# Altium project AMC_FMC_Carrier.PrjPcb (part 6 of 9)

## Sheet IPMI.SchDoc
size A4; DocumentNumber: 5; SheetNumber: 5; SheetTotal: 30
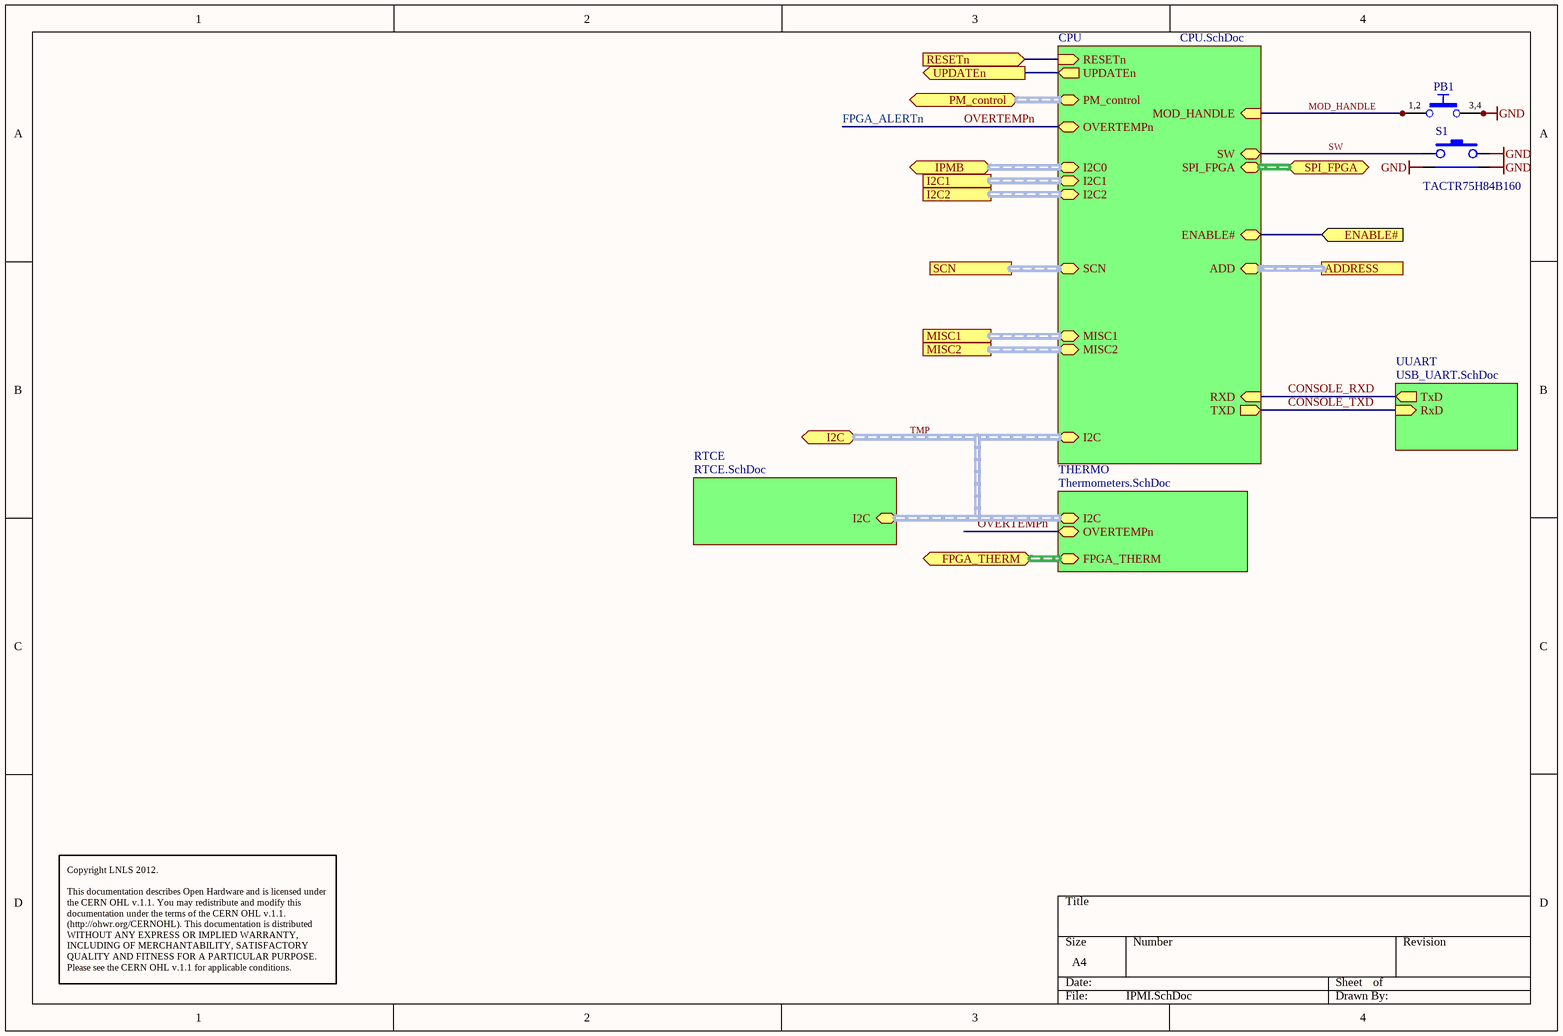
[diagram p12: IPMI.SchDoc]

### Parts
PB1  Push Button  [SW_C&K_HDT0001]  (value not drawn)
S1  TACTR75H84B160  [PB_ALPS_SKHHLQA010]

### Sub-sheets
CPU = CPU.SchDoc: ENABLE#, PM_control (harness PM_control), OVERTEMPn (bidir), MOD_HANDLE (in), SPI_FPGA (harness SPI), SW, RXD (in), TXD (out), RESETn (in), UPDATEn (out), I2C (harness I2C), I2C0 (harness I2C), I2C1 (harness I2C), I2C2 (harness I2C), MISC1 (harness MISC), MISC2 (harness MISC), ADD (harness AMC_ADD), SCN (harness SCN)
RTCE = RTCE.SchDoc (file not in this document): I2C (harness I2C)
THERMO = Thermometers.SchDoc (file not in this document): OVERTEMPn (bidir), FPGA_THERM (harness FPGA_THERM), I2C (harness I2C)
UUART = USB_UART.SchDoc: TxD (out), RxD (in)

### Ports
ADDRESS (harness AMC_ADD), ENABLE# (in), FPGA_THERM (harness FPGA_THERM), I2C1 (harness I2C), I2C2 (harness I2C), I2C (harness I2C), IPMB (harness I2C), MISC1 (harness MISC), MISC2 (harness MISC), PM_control (harness PM_control), RESETn (in), SCN (harness SCN), SPI_FPGA (harness SPI), UPDATEn (out)

### Nets
GND: PB1.3 PB1.4 S1.2 S1.3 S1.4
CONSOLE_RXD: sheet CPU/RXD, sheet UUART/TxD
CONSOLE_TXD: sheet CPU/TXD, sheet UUART/RxD
FPGA_ALERTn: sheet CPU/OVERTEMPn, sheet THERMO/OVERTEMPn  [also labelled OVERTEMPn]
MOD_HANDLE: PB1.1 PB1.2 ; sheet CPU/MOD_HANDLE
RESETn: port RESETn, sheet CPU/RESETn
SCN_ENn: port ENABLE#, sheet CPU/ENABLE#
SW: S1.1 ; sheet CPU/SW
UPDATEn: port UPDATEn, sheet CPU/UPDATEn

### Buses and harness runs
harness port ADDRESS = sheet CPU/ADD
harness port FPGA_THERM = sheet THERMO/FPGA_THERM
harness port I2C1 = sheet CPU/I2C1
harness port I2C2 = sheet CPU/I2C2
harness port IPMB = sheet CPU/I2C0
harness port MISC1 = sheet CPU/MISC1
harness port MISC2 = sheet CPU/MISC2
harness port PM_control = sheet CPU/PM_control
harness port SCN = sheet CPU/SCN
harness port SPI_FPGA = sheet CPU/SPI_FPGA
harness TMP = port I2C = sheet CPU/I2C = sheet RTCE/I2C = sheet THERMO/I2C

### Notes on the sheet
- Copyright LNLS 2012.
  This documentation describes Open Hardware and is licensed under the CERN OHL v.1.1. You may redistribute and modify this documentation under the terms of the CERN OHL v.1.1. (http://ohwr.org/CERNOHL). This documentation is distributed WITHOUT ANY EXPRESS OR IMPLIED WARRANTY, INCLUDING OF MERCHANTABILITY, SATISFACTORY QUALITY AND FITNESS FOR A PARTICULAR PURPOSE. Please see the CERN OHL v.1.1 for applicable conditions.
- (in symbol SW_C&K_HDT0001) 1,2; 3,4

### Library data of the parts
PB1 = SW_C&K_HDT0001: Push-Button Switch SPDT; Part Description: 5VDC 1mA SPST-NO Micro Mini Surface Surface Mount Detect Push-Button Switch, HDT Serie; Manufacturer: C&K; Table: Switches; Part Number: SW_C&K_HDT0001; Component Kind: Standard; Component Type: Standard; Pin Count: 4; PackageDescription: Body 3.5x2.8mm, Micro Mini Surface Mount Detect Switches, HDT Serie; Family: Push Button; Mounted: Yes; Socket: No; SMD: Yes; Status: None; Manufacturer Part Number: HDT0001; ComponentHeight: 3.35mm; HelpURL: \\cern.ch\dfs\Applications\Altium\Datasheets\SW_C&K_HDT0001.pdf; Author: CERN DEM JLC; CreateDate: 2012-08-15; LatestRevisionDate: 2012-08-15
S1 = SW-PB_RA_5.8mm: Push button

## Sheet CPU.SchDoc
size A3; DocumentNumber: 11; SheetNumber: 11; SheetTotal: 30
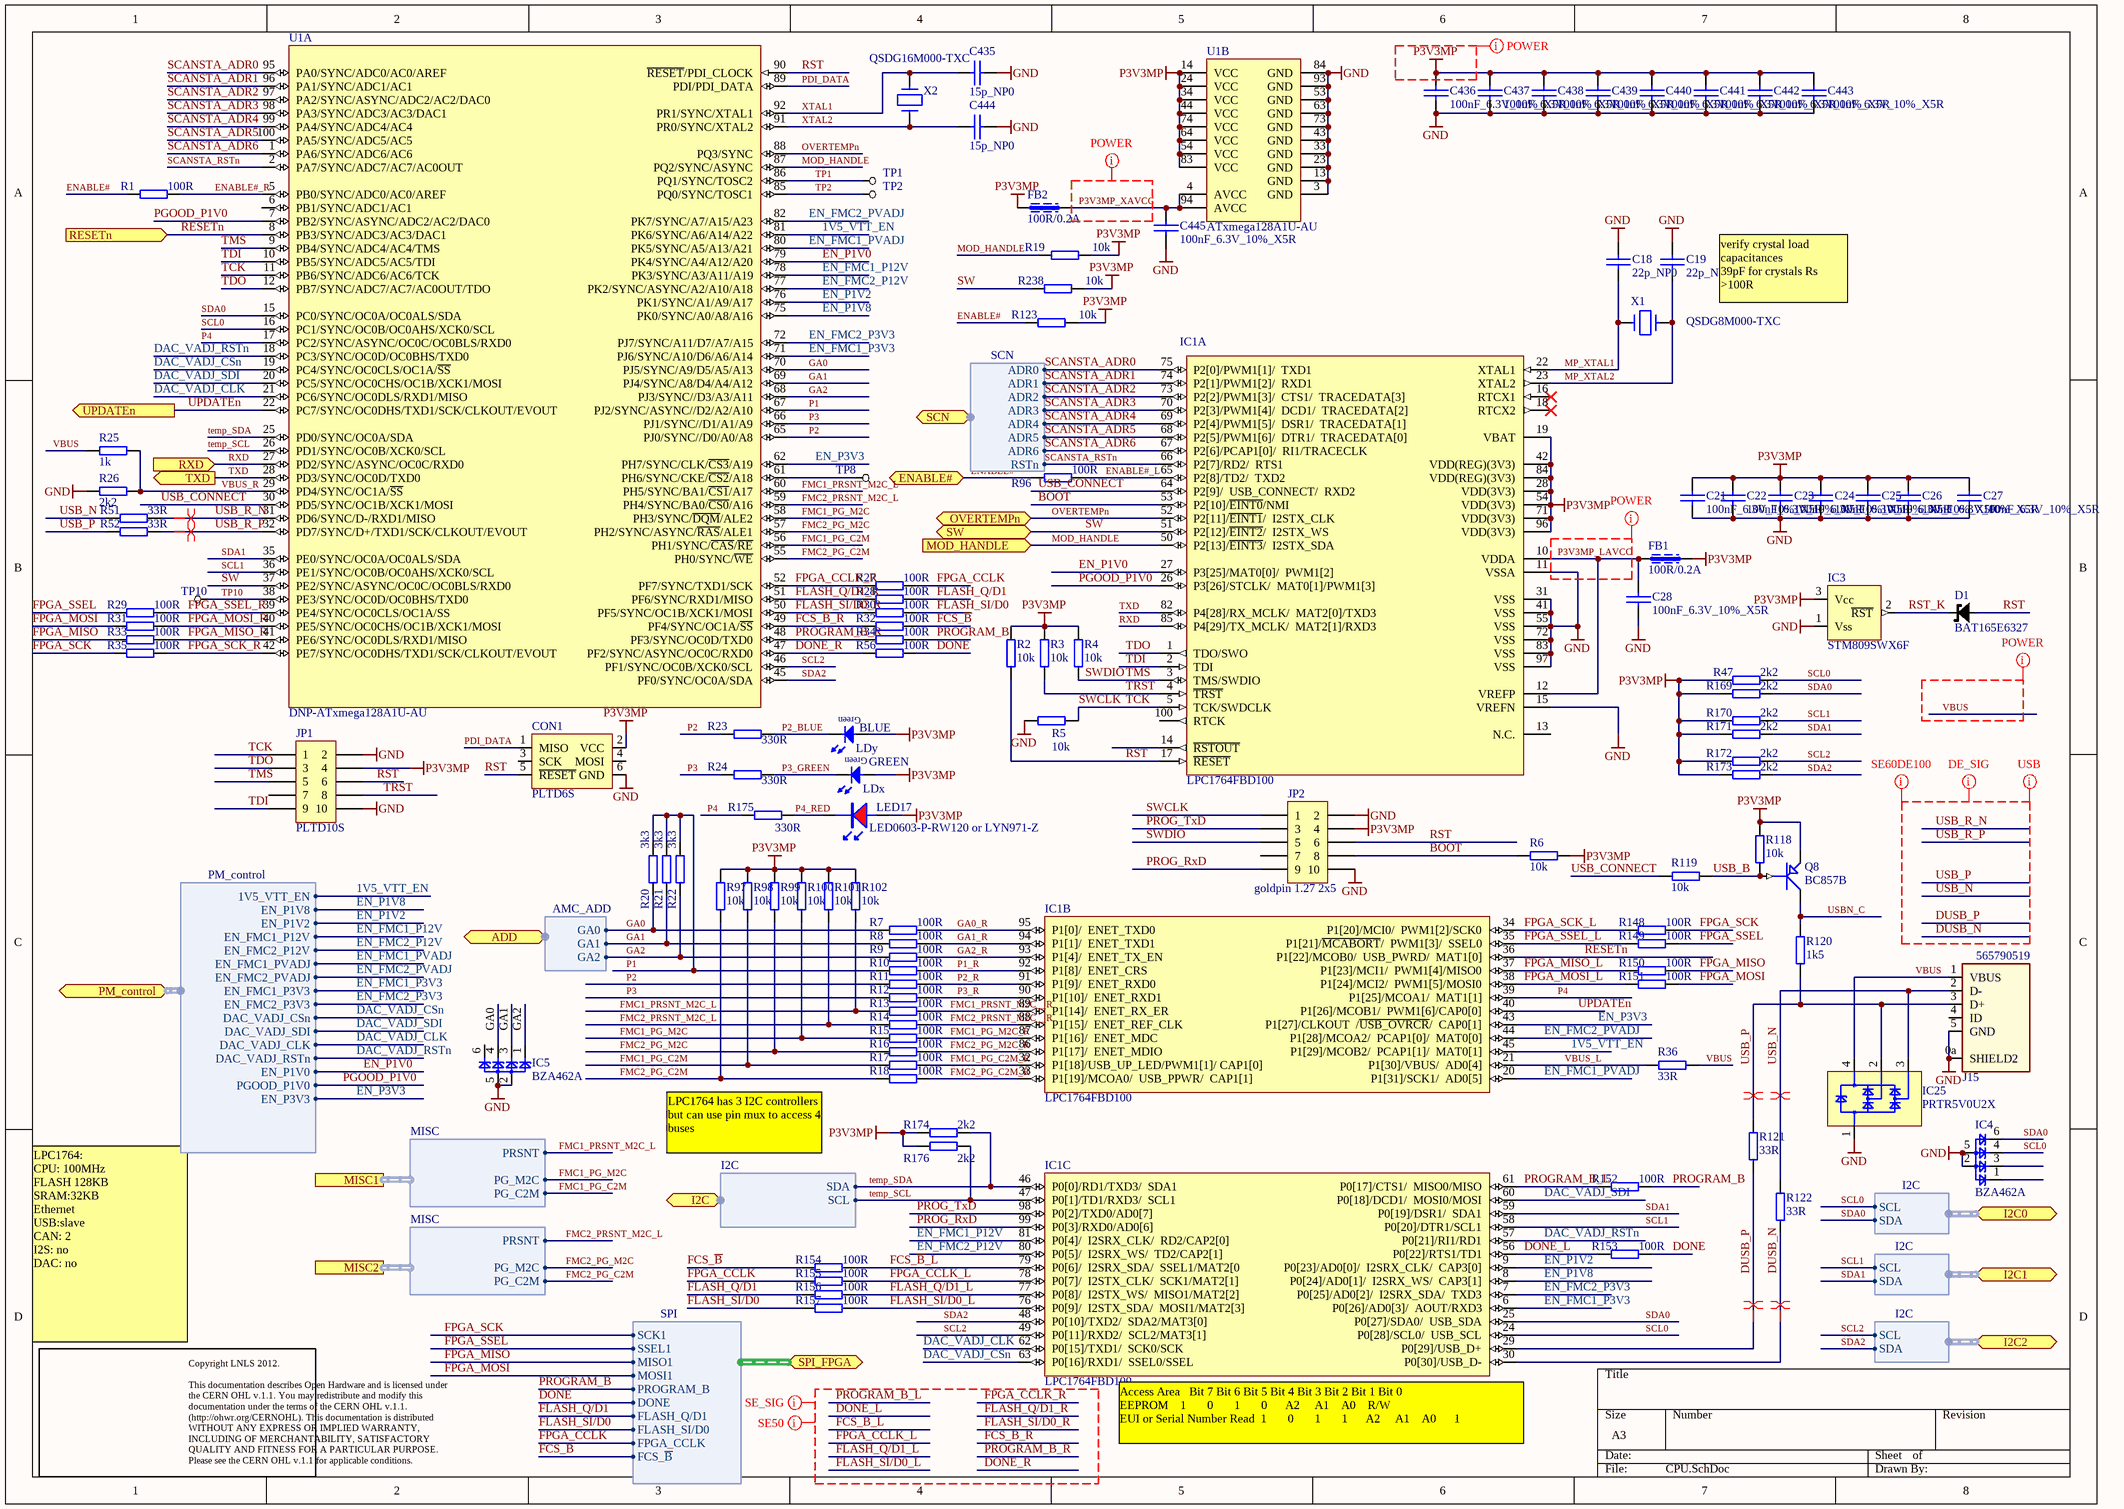
[diagram p13: CPU.SchDoc]

### Parts
C18  22p_NP0  [0402C]
C19  22p_NP0  [0402C]
C21  100nF_6.3V_10%_X5R  [0201C]
C22  100nF_6.3V_10%_X5R  [0201C]
C23  100nF_6.3V_10%_X5R  [0201C]
C24  100nF_6.3V_10%_X5R  [0201C]
C25  100nF_6.3V_10%_X5R  [0201C]
C26  100nF_6.3V_10%_X5R  [0201C]
C27  100nF_6.3V_10%_X5R  [0201C]
C28  100nF_6.3V_10%_X5R  [0201C]
C435  15p_NP0  [0402C]
C436  100nF_6.3V_10%_X5R  [0201C]
C437  100nF_6.3V_10%_X5R  [0201C]
C438  100nF_6.3V_10%_X5R  [0201C]
C439  100nF_6.3V_10%_X5R  [0201C]
C440  100nF_6.3V_10%_X5R  [0201C]
C441  100nF_6.3V_10%_X5R  [0201C]
C442  100nF_6.3V_10%_X5R  [0201C]
C443  100nF_6.3V_10%_X5R  [0201C]
C444  15p_NP0  [0402C]
C445  100nF_6.3V_10%_X5R  [0201C]
CON1  PLTD6S  [PLTD6S]
D1  BAT165E6327  [SOD323]
FB1  100R/0.2A  [0402L]
FB2  100R/0.2A  [0402L]
IC1  LPC1764FBD100  [LQFP100-LPC]  (parts A,B,C of 3)
IC3  STM809SWX6F  [SOT-23]
IC4  BZA462A  [SOT23-6]
IC5  BZA462A  [SOT23-6]
IC25  PRTR5V0U2X  [sot143b]
J15  565790519  [CON_USB_565790519]
JP1  PLTD10S  [PLTD10S]
JP2  goldpin 1.27 2x5  [CON_2x5_MINI]
LDx  GREEN  [LED_AVAGO_HSME-C120]
LDy  BLUE  [LED_AVAGO_HSME-C120]
LED17  LED0603-P-RW120 or LYN971-Z  [led_0603R]
Q8  BC857B  [SOT-23]
R1  100R  [0402R]
R2  10k  [0402R]
R3  10k  [0402R]
R4  10k  [0402R]
R5  10k  [0402R]
R6  10k  [0402R]
R7  100R  [0402R]
R8  100R  [0402R]
R9  100R  [0402R]
R10  100R  [0402R]
R11  100R  [0402R]
R12  100R  [0402R]
R13  100R  [0402R]
R14  100R  [0402R]
R15  100R  [0402R]
R16  100R  [0402R]
R17  100R  [0402R]
R18  100R  [0402R]
R19  10k  [0402R]
R20  3k3  [0402R]
R21  3k3  [0402R]
R22  3k3  [0402R]
R23  330R  [0402R]
R24  330R  [0402R]
R25  1k  [0402R]
R26  2k2  [0402R]
R27  100R  [0402R]
R28  100R  [0402R]
R29  100R  [0402R]
R30  100R  [0402R]
R31  100R  [0402R]
R32  100R  [0402R]
R33  100R  [0402R]
R34  100R  [0402R]
R35  100R  [0402R]
R36  33R  [0402R]
R47  2k2  [0402R]
R51  33R  [0402R]
R52  33R  [0402R]
R56  100R  [0402R]
R96  100R  [0402R]
R97  10k  [0402R]
R98  10k  [0402R]
R99  10k  [0402R]
R100  10k  [0402R]
R101  10k  [0402R]
R102  10k  [0402R]
R118  10k  [0402R]
R119  10k  [0402R]
R120  1k5  [0402R]
R121  33R  [0402R]
R122  33R  [0402R]
R123  10k  [0402R]
R148  100R  [0402R]
R149  100R  [0402R]
R150  100R  [0402R]
R151  100R  [0402R]
R152  100R  [0402R]
R153  100R  [0402R]
R154  100R  [0402R]
R155  100R  [0402R]
R156  100R  [0402R]
R157  100R  [0402R]
R169  2k2  [0402R]
R170  2k2  [0402R]
R171  2k2  [0402R]
R172  2k2  [0402R]
R173  2k2  [0402R]
R174  2k2  [0402R]
R175  330R  [0402R]
R176  2k2  [0402R]
R238  10k  [0402R]
TP1  TP  [TP]  (value not drawn)
TP2  TP  [TP]  (value not drawn)
TP8  TP  [TP]  (value not drawn)
TP10  TP  [TP]  (value not drawn)
U1  DNP-ATxmega128A1U-AU  [TQFP100]  (parts A,B of 2)
X1  QSDG8M000-TXC  [XTAL_5.0*3.2]
X2  QSDG16M000-TXC  [XTAL_5.0*3.2]

### Ports
ADD (harness AMC_ADD), ENABLE#, I2C0 (harness I2C), I2C1 (harness I2C), I2C2 (harness I2C), I2C (harness I2C), MISC1 (harness MISC), MISC2 (harness MISC), MOD_HANDLE (in), OVERTEMPn (bidir), PM_control (harness PM_control), RESETn (in), RXD (in), SCN (harness SCN), SPI_FPGA (harness SPI), SW, TXD (out), UPDATEn (out)

### Harnesses
SPI: SCK1, SSEL1, MISO1, MOSI1, FLASH_Q/D1, FLASH_SI/D0, PROGRAM_B, DONE, FPGA_CCLK, FCS_~{B}
PM_control: EN_P1V8, EN_P1V2, EN_FMC1_P12V, EN_FMC2_P12V, EN_FMC1_PVADJ, EN_FMC2_PVADJ, EN_FMC1_P3V3, EN_FMC2_P3V3, DAC_VADJ_CSn, DAC_VADJ_SDI, DAC_VADJ_CLK, DAC_VADJ_RSTn, 1V5_VTT_EN, EN_P1V0, PGOOD_P1V0, EN_P3V3
I2C: SCL, SDA
MISC: PRSNT, PG_M2C, PG_C2M
AMC_ADD: GA0, GA1, GA2
SCN: ADR0, ADR1, ADR2, ADR3, ADR4, ADR5, ADR6, RSTn

### Nets
GND: C18.1 C19.1 C21.1 C22.1 C23.1 C24.1 C25.1 C26.1 C27.1 C28.2 C435.1 C436.1 C437.1 C438.1 C439.1 C440.1 C441.1 C442.1 C443.1 C444.1 C445.2 CON1.6(GND) IC1.11(VSSA) IC1.15(VREFN) IC1.31(VSS) IC1.41(VSS) IC1.55(VSS) IC1.72(VSS) IC1.83(VSS) IC1.97(VSS) IC3.1(Vss) IC4.2 IC4.5 IC5.2 IC5.5 IC25.1 J15.0(SHIELD2) J15.0a(SHIELD2) J15.5(GND) JP1.2 JP1.10 JP2.2 JP2.10 R5.2 R26.2 U1.3(GND) U1.13(GND) U1.23(GND) U1.33(GND) U1.43(GND) U1.53(GND) U1.63(GND) U1.73(GND) U1.84(GND) U1.93(GND)
P3V3MP: C21.2 C22.2 C23.2 C24.2 C25.2 C26.2 C27.2 C436.2 C437.2 C438.2 C439.2 C440.2 C441.2 C442.2 C443.2 CON1.2(VCC) FB1.2 FB2.1 IC1.19(VBAT) IC1.28(VDD(3V3)) IC1.42(VDD(REG)(3V3)) IC1.54(VDD(3V3)) IC1.71(VDD(3V3)) IC1.84(VDD(REG)(3V3)) IC1.96(VDD(3V3)) IC3.3(Vcc) JP1.4 JP2.4 LDx.2(A) LDy.2(A) LED17.A Q8.2(E) R2.2 R3.2 R4.2 R6.2 R19.2 R47.1 R97.2 R98.2 R99.2 R100.2 R101.2 R102.2 R118.2 R123.2 R169.1 R170.1 R171.1 R172.1 R173.1 R174.1 R176.1 R238.2 U1.14(VCC) U1.24(VCC) U1.34(VCC) U1.44(VCC) U1.54(VCC) U1.64(VCC) U1.74(VCC) U1.83(VCC)
1V5_VTT_EN: IC1.45(P1[29]/MCOB2/__PCAP1[1]/__MAT0[1]) U1.81(PK6/SYNC/A6/A14/A22) ; port PM_control.1V5_VTT_EN  [project net PM.1V5_VTT_EN]
BOOT: IC1.53(P2[10]/~{EINT0}/NMI) JP2.8 R6.1
DAC_VADJ_CLK: IC1.62(P0[15]/TXD1/__SCK0/SCK) U1.21(PC6/SYNC/OC0DLS/RXD1/MISO) ; port PM_control.DAC_VADJ_CLK  [project net PM.DAC_VADJ_CLK]
DAC_VADJ_CSn: IC1.63(P0[16]/RXD1/__SSEL0/SSEL) U1.19(PC4/SYNC/OC0CLS/OC1A/~{SS}) ; port PM_control.DAC_VADJ_CSn  [project net PM.DAC_VADJ_CSn]
DAC_VADJ_RSTn: IC1.57(P0[21]/RI1/RD1) U1.18(PC3/SYNC/OC0D/OC0BHS/TXD0) ; port PM_control.DAC_VADJ_RSTn  [project net PM.DAC_VADJ_RSTn]
DAC_VADJ_SDI: IC1.60(P0[18]/DCD1/__MOSI0/MOSI) U1.20(PC5/SYNC/OC0CHS/OC1B/XCK1/MOSI) ; port PM_control.DAC_VADJ_SDI  [project net PM.DAC_VADJ_SDI]
DONE: R56.2 R153.2 ; port SPI_FPGA.DONE  [project net FSPI.DONE]
DONE_L: IC1.56(P0[22]/RTS1/TD1) R153.1
DONE_R: R56.1 U1.47(PF2/SYNC/ASYNC/OC0C/RXD0)
DUSB_N: IC1.30(P0[30]/USB_D-) R122.1
DUSB_P: IC1.29(P0[29]/USB_D+) R121.1
EN_FMC1_P3V3: IC1.6(P0[26]/AD0[3]/__AOUT/RXD3) U1.71(PJ6/SYNC/A10/D6/A6/A14) ; port PM_control.EN_FMC1_P3V3  [project net PM.EN_FMC1_P3V3]
EN_FMC1_P12V: IC1.81(P0[4]/__I2SRX_CLK/__RD2/CAP2[0]) U1.78(PK3/SYNC/A3/A11/A19) ; port PM_control.EN_FMC1_P12V  [project net PM.EN_FMC1_P12V]
EN_FMC1_PVADJ: IC1.20(P1[31]/SCK1/__AD0[5]) U1.80(PK5/SYNC/A5/A13/A21) ; port PM_control.EN_FMC1_PVADJ  [project net PM.EN_FMC1_PVADJ]
EN_FMC2_P3V3: IC1.7(P0[25]/AD0[2]/__I2SRX_SDA/__TXD3) U1.72(PJ7/SYNC/A11/D7/A7/A15) ; port PM_control.EN_FMC2_P3V3  [project net PM.EN_FMC2_P3V3]
EN_FMC2_P12V: IC1.80(P0[5]/__I2SRX_WS/__TD2/CAP2[1]) U1.77(PK2/SYNC/ASYNC/A2/A10/A18) ; port PM_control.EN_FMC2_P12V  [project net PM.EN_FMC2_P12V]
EN_FMC2_PVADJ: IC1.44(P1[28]/MCOA2/__PCAP1[0]/__MAT0[0]) U1.82(PK7/SYNC/A7/A15/A23) ; port PM_control.EN_FMC2_PVADJ  [project net PM.EN_FMC2_PVADJ]
EN_P1V0: IC1.27(P3[25]/MAT0[0]/__PWM1[2]) U1.79(PK4/SYNC/A4/A12/A20) ; port PM_control.EN_P1V0  [project net PM.EN_P1V0]
EN_P1V2: IC1.9(P0[23]/AD0[0]/__I2SRX_CLK/__CAP3[0]) U1.76(PK1/SYNC/A1/A9/A17) ; port PM_control.EN_P1V2  [project net PM.EN_P1V2]
EN_P1V8: IC1.8(P0[24]/AD0[1]/__I2SRX_WS/__CAP3[1]) U1.75(PK0/SYNC/A0/A8/A16) ; port PM_control.EN_P1V8  [project net PM.EN_P1V8]
EN_P3V3: IC1.43(P1[27]/CLKOUT__/~{USB_OVRCR}/__CAP0[1]) U1.62(PH7/SYNC/CLK/~{CS3}/A19) ; port PM_control.EN_P3V3  [project net PM.EN_P3V3]
ENABLE#: R1.1 R96.1 R123.1 ; port ENABLE#  [project net SCN_ENn]
ENABLE#_L: IC1.65(P2[8]/TD2/__TXD2) R96.2
ENABLE#_R: R1.2 U1.5(PB0/SYNC/ADC0/AC0/AREF)
FCS_~{B}: R32.2 R154.1 ; port SPI_FPGA.FCS_~{B}  [project net FSPI.FCS_~{B}]
FCS_~{B}_L: IC1.79(P0[6]/__I2SRX_SDA/__SSEL1/MAT2[0) R154.2
FCS_~{B}_R: R32.1 U1.49(PF4/SYNC/OC1A/~{SS})
FLASH_Q/D1: R28.2 R156.1 ; port SPI_FPGA.FLASH_Q/D1  [project net FSPI.FLASH_Q/D1]
FLASH_Q/D1_L: IC1.77(P0[8]/__I2STX_WS/__MISO1/MAT2[2]) R156.2
FLASH_Q/D1_R: R28.1 U1.51(PF6/SYNC/RXD1/MISO)
FLASH_SI/D0: R30.2 R157.1 ; port SPI_FPGA.FLASH_SI/D0  [project net FSPI.FLASH_SI/D0]
FLASH_SI/D0_L: IC1.76(P0[9]/__I2STX_SDA/__MOSI1/MAT2[3]) R157.2
FLASH_SI/D0_R: R30.1 U1.50(PF5/SYNC/OC1B/XCK1/MOSI)
FMC1_PG_C2M: R17.1 R98.1 U1.56(PH1/SYNC/~{CAS}/~{RE}) ; port MISC1.PG_C2M  [project net MISC1.PG_C2M]
FMC1_PG_C2M_R: IC1.32(P1[18]/USB_UP_LED/PWM1[1]/_CAP1[0]) R17.2
FMC1_PG_M2C: R15.1 R100.1 U1.58(PH3/SYNC/~{DQM}/ALE2) ; port MISC1.PG_M2C  [project net MISC1.PG_M2C]
FMC1_PG_M2C_R: IC1.87(P1[16]/__ENET_MDC) R15.2
FMC1_PRSNT_M2C__R: IC1.89(P1[14]/__ENET_RX_ER) R13.2
FMC1_PRSNT_M2C_L: R13.1 R102.1 U1.60(PH5/SYNC/BA1/~{CS1}/A17) ; port MISC1.PRSNT  [project net MISC1.PRSNT]
FMC2_PG_C2M: R18.1 R97.1 U1.55(PH0/SYNC/~{WE}) ; port MISC2.PG_C2M  [project net MISC2.PG_C2M]
FMC2_PG_C2M_R: IC1.33(P1[19]/MCOA0/__USB_PPWR/__CAP1[1]) R18.2
FMC2_PG_M2C: R16.1 R99.1 U1.57(PH2/SYNC/ASYNC/~{RAS}/ALE1) ; port MISC2.PG_M2C  [project net MISC2.PG_M2C]
FMC2_PG_M2C_R: IC1.86(P1[17]/__ENET_MDIO) R16.2
FMC2_PRSNT_M2C__R: IC1.88(P1[15]/__ENET_REF_CLK) R14.2
FMC2_PRSNT_M2C_L: R14.1 R101.1 U1.59(PH4/SYNC/BA0/~{CS0}/A16) ; port MISC2.PRSNT  [project net MISC2.PRSNT]
FPGA_CCLK: R27.2 R155.1 ; port SPI_FPGA.FPGA_CCLK  [project net FSPI.FPGA_CCLK]
FPGA_CCLK_L: IC1.78(P0[7]/__I2STX_CLK/__SCK1/MAT2[1]) R155.2
FPGA_CCLK_R: R27.1 U1.52(PF7/SYNC/TXD1/SCK)
FPGA_MISO: R33.1 R150.2 ; port SPI_FPGA.MISO1  [project net FSPI.MISO1]
FPGA_MISO_L: IC1.37(P1[23]/MCI1/__PWM1[4]/MISO0) R150.1
FPGA_MISO_R: R33.2 U1.41(PE6/SYNC/OC0DLS/RXD1/MISO)
FPGA_MOSI: R31.1 R151.2 ; port SPI_FPGA.MOSI1  [project net FSPI.MOSI1]
FPGA_MOSI_L: IC1.38(P1[24]/MCI2/__PWM1[5]/MOSI0) R151.1
FPGA_MOSI_R: R31.2 U1.40(PE5/SYNC/OC0CHS/OC1B/XCK1/MOSI)
FPGA_SCK: R35.1 R148.2 ; port SPI_FPGA.SCK1  [project net FSPI.SCK1]
FPGA_SCK_L: IC1.34(P1[20]/MCI0/__PWM1[2]/SCK0) R148.1
FPGA_SCK_R: R35.2 U1.42(PE7/SYNC/OC0DHS/TXD1/SCK/CLKOUT/EVOUT)
FPGA_SSEL: R29.1 R149.2 ; port SPI_FPGA.SSEL1  [project net FSPI.SSEL1]
FPGA_SSEL_L: IC1.35(P1[21]/~{MCABORT}/__PWM1[3]/__SSEL0) R149.1
FPGA_SSEL_R: R29.2 U1.39(PE4/SYNC/OC0CLS/OC1A/SS)
GA0: IC5.4 R7.1 R20.1 U1.70(PJ5/SYNC/A9/D5/A5/A13) ; port ADD.GA0  [project net ADD.GA0]
GA0_R: IC1.95(P1[0]/__ENET_TXD0) R7.2
GA1: IC5.3 R8.1 R21.1 U1.69(PJ4/SYNC/A8/D4/A4/A12) ; port ADD.GA1  [project net ADD.GA1]
GA1_R: IC1.94(P1[1]/__ENET_TXD1) R8.2
GA2: IC5.1 R9.1 R22.1 U1.68(PJ3/SYNC//D3/A3/A11) ; port ADD.GA2  [project net ADD.GA2]
GA2_R: IC1.93(P1[4]/__ENET_TX_EN) R9.2
MOD_HANDLE: IC1.50(P2[13]/~{EINT3}/__I2STX_SDA) R19.1 U1.87(PQ2/SYNC/ASYNC) ; port MOD_HANDLE
MP_XTAL1: C18.2 IC1.22(XTAL1) X1.1
MP_XTAL2: C19.2 IC1.23(XTAL2) X1.2
OVERTEMPn: IC1.52(P2[11]/~{EINT1}/__I2STX_CLK) U1.88(PQ3/SYNC) ; port OVERTEMPn  [project net FPGA_ALERTn]
P1: R10.1 R20.2 R21.2 R22.2 U1.67(PJ2/SYNC/ASYNC//D2/A2/A10)
P1_R: IC1.92(P1[8]/__ENET_CRS) R10.2
P2: R11.1 R23.1 U1.65(PJ0/SYNC//D0/A0/A8)
P2_BLUE: LDy.1(C) R23.2
P2_R: IC1.91(P1[9]/__ENET_RXD0) R11.2
P3: R12.1 R24.1 U1.66(PJ1/SYNC//D1/A1/A9)
P3_GREEN: LDx.1(C) R24.2
P3_R: IC1.90(P1[10]/__ENET_RXD1) R12.2
P3V3MP_LAVCC: C28.1 FB1.1 IC1.10(VDDA) IC1.12(VREFP)
P3V3MP_XAVCC: C445.1 FB2.2 U1.4(AVCC) U1.94(AVCC)
P4: IC1.39(P1[25]/MCOA1/__MAT1[1]) R175.1 U1.17(PC2/SYNC/ASYNC/OC0C/OC0BLS/RXD0)
P4_RED: LED17.K R175.2
PDI_DATA: CON1.1(MISO) U1.89(PDI/PDI_DATA)
PGOOD_P1V0: IC1.26(P3[26]/STCLK/__MAT0[1]/PWM1[3]) U1.7(PB2/SYNC/ASYNC/ADC2/AC2/DAC0) ; port PM_control.PGOOD_P1V0  [project net PM.PGOOD_P1V0]
PROG_RxD: IC1.99(P0[3]/RXD0/AD0[6]) JP2.9
PROG_TxD: IC1.98(P0[2]/TXD0/AD0[7]) JP2.3
PROGRAM_B: R34.2 R152.2 ; port SPI_FPGA.PROGRAM_B  [project net FSPI.PROGRAM_B]
PROGRAM_B_L: IC1.61(P0[17]/CTS1/__MISO0/MISO) R152.1
PROGRAM_B_R: R34.1 U1.48(PF3/SYNC/OC0D/TXD0)
RESETn: IC1.36(P1[22]/MCOB0/__USB_PWRD/__MAT1[0]) U1.8(PB3/SYNC/ADC3/AC3/DAC1) ; port RESETn
RST: CON1.5(~{RESET}) D1.A IC1.17(~{RESET}) JP1.6 JP2.6 R2.1 U1.90(~{RESET}/PDI_CLOCK)
RST_K: D1.K IC3.2(~{RST})
RXD: IC1.85(P4[29]/TX_MCLK/__MAT2[1]/RXD3) U1.27(PD2/SYNC/ASYNC/OC0C/RXD0) ; port RXD  [project net CONSOLE_RXD]
SCANSTA_ADR0: IC1.75(P2[0]/PWM1[1]/__TXD1) U1.95(PA0/SYNC/ADC0/AC0/AREF) ; port SCN.ADR0  [project net SCN.ADR0]
SCANSTA_ADR1: IC1.74(P2[1]/PWM1[2]/__RXD1) U1.96(PA1/SYNC/ADC1/AC1) ; port SCN.ADR1  [project net SCN.ADR1]
SCANSTA_ADR2: IC1.73(P2[2]/PWM1[3]/__CTS1/__TRACEDATA[3]) U1.97(PA2/SYNC/ASYNC/ADC2/AC2/DAC0) ; port SCN.ADR2  [project net SCN.ADR2]
SCANSTA_ADR3: IC1.70(P2[3]/PWM1[4]/__DCD1/__TRACEDATA[2]) U1.98(PA3/SYNC/ADC3/AC3/DAC1) ; port SCN.ADR3  [project net SCN.ADR3]
SCANSTA_ADR4: IC1.69(P2[4]/PWM1[5]/__DSR1/__TRACEDATA[1]) U1.99(PA4/SYNC/ADC4/AC4) ; port SCN.ADR4  [project net SCN.ADR4]
SCANSTA_ADR5: IC1.68(P2[5]/PWM1[6]/__DTR1/__TRACEDATA[0]) U1.100(PA5/SYNC/ADC5/AC5) ; port SCN.ADR5  [project net SCN.ADR5]
SCANSTA_ADR6: IC1.67(P2[6]/PCAP1[0]/__RI1/TRACECLK) U1.1(PA6/SYNC/ADC6/AC6) ; port SCN.ADR6  [project net SCN.ADR6]
SCANSTA_RSTn: IC1.66(P2[7]/RD2/__RTS1) U1.2(PA7/SYNC/ADC7/AC7/AC0OUT) ; port SCN.RSTn  [project net SCN.RSTn]
SCL0: IC1.24(P0[28]/SCL0/__USB_SCL) IC4.4 R47.2 U1.16(PC1/SYNC/OC0B/OC0AHS/XCK0/SCL) ; port I2C0.SCL  [project net IPMB.SCL]
SCL1: IC1.58(P0[20]/DTR1/SCL1) R170.2 U1.36(PE1/SYNC/OC0B/OC0AHS/XCK0/SCL) ; port I2C1.SCL  [project net I2C1.SCL]
SCL2: IC1.49(P0[11]/RXD2/__SCL2/MAT3[1]) R172.2 U1.46(PF1/SYNC/OC0B/XCK0/SCL) ; port I2C2.SCL  [project net I2C2.SCL]
SDA0: IC1.25(P0[27]/SDA0/__USB_SDA) IC4.6 R169.2 U1.15(PC0/SYNC/OC0A/OC0ALS/SDA) ; port I2C0.SDA  [project net IPMB.SDA]
SDA1: IC1.59(P0[19]/DSR1/__SDA1) R171.2 U1.35(PE0/SYNC/OC0A/OC0ALS/SDA) ; port I2C1.SDA  [project net I2C1.SDA]
SDA2: IC1.48(P0[10]/TXD2/__SDA2/MAT3[0]) R173.2 U1.45(PF0/SYNC/OC0A/SDA) ; port I2C2.SDA  [project net I2C2.SDA]
SW: IC1.51(P2[12]/~{EINT2}/__I2STX_WS) R238.1 U1.37(PE2/SYNC/ASYNC/OC0C/OC0BLS/RXD0) ; port SW
SWCLK: IC1.5(TCK/SWDCLK) JP1.1 JP2.1 R5.1 U1.11(PB6/SYNC/ADC6/AC6/TCK)  [also labelled TCK]
SWDIO: IC1.3(TMS/SWDIO) JP1.5 JP2.5 R4.1 U1.9(PB4/SYNC/ADC4/AC4/TMS)  [also labelled TMS]
TDI: IC1.2(TDI) JP1.9 U1.10(PB5/SYNC/ADC5/AC5/TDI)
TDO: IC1.1(TDO/SWO) JP1.3 U1.12(PB7/SYNC/ADC7/AC7/AC0OUT/TDO)
temp_SCL: IC1.47(P0[1]/TD1/RXD3/__SCL1) R176.2 U1.26(PD1/SYNC/OC0B/XCK0/SCL) ; port I2C.SCL  [project net CPU.SCL]
temp_SDA: IC1.46(P0[0]/RD1/TXD3/__SDA1) R174.2 U1.25(PD0/SYNC/OC0A/SDA) ; port I2C.SDA  [project net CPU.SDA]
TP1: TP1.1 U1.86(PQ1/SYNC/TOSC2)
TP2: TP2.1 U1.85(PQ0/SYNC/TOSC1)
TP10: TP10.1 U1.38(PE3/SYNC/OC0D/OC0BHS/TXD0)
TRST: IC1.4(~{TRST}) JP1.8 R3.1
TXD: IC1.82(P4[28]/RX_MCLK/__MAT2[0]/TXD3) U1.28(PD3/SYNC/OC0D/TXD0) ; port TXD  [project net CONSOLE_TXD]
UPDATEn: IC1.40(P1[26]/MCOB1/__PWM1[6]/CAP0[0]) U1.22(PC7/SYNC/OC0DHS/TXD1/SCK/CLKOUT/EVOUT) ; port UPDATEn
USB_B: Q8.1(B) R118.1 R119.2
USB_CONNECT: IC1.64(P2[9]/__USB_CONNECT/__RXD2) R119.1 U1.30(PD5/SYNC/OC1B/XCK1/MOSI)
USB_N: IC25.3 J15.2(D-) R51.1 R122.2
USB_P: IC25.2 J15.3(D+) R52.1 R120.1 R121.2
USB_R_N: R51.2 U1.31(PD6/SYNC/D-/RXD1/MISO)
USB_R_P: R52.2 U1.32(PD7/SYNC/D+/TXD1/SCK/CLKOUT/EVOUT)
USBN_C: Q8.3(C) R120.2
VBUS: IC25.4 J15.1(VBUS) R25.2 R36.1
VBUS_L: IC1.21(P1[30]/VBUS/__AD0[4]) R36.2
VBUS_R: R25.1 R26.1 U1.29(PD4/SYNC/OC1A/~{SS})
XTAL1: C435.2 U1.92(PR1/SYNC/XTAL1) X2.1
XTAL2: C444.2 U1.91(PR0/SYNC/XTAL2) X2.2
NetTP8_1: TP8.1 U1.61(PH6/SYNC/CKE/~{CS2}/A18)

Not connected (* = marked no-connect by the designer): CON1 3(SCK) 4(MOSI); IC1 13(N.C.) 14(~{RSTOUT}) 16(RTCX1)* 18(RTCX2)* 100(RTCK); IC4 1 3; IC5 6; J15 4(ID); JP1 7; JP2 7; U1 6(PB1/SYNC/ADC1/AC1)

### Layout directives
differential pair: DUSB_N, DUSB_P, USB_N, USB_P, USB_R_N, USB_R_P
net class POWER: P3V3MP, P3V3MP_LAVCC, P3V3MP_XAVCC, VBUS
net class SE_SIG: DONE_L, DONE_R, FCS_~{B}_L, FCS_~{B}_R, FLASH_Q/D1_L, FLASH_Q/D1_R, FLASH_SI/D0_L, FLASH_SI/D0_R, FPGA_CCLK_L, FPGA_CCLK_R, PROGRAM_B_L, PROGRAM_B_R
net class SE50: DONE_L, DONE_R, FCS_~{B}_L, FCS_~{B}_R, FLASH_Q/D1_L, FLASH_Q/D1_R, FLASH_SI/D0_L, FLASH_SI/D0_R, FPGA_CCLK_L, FPGA_CCLK_R, PROGRAM_B_L, PROGRAM_B_R
net class SE60DE100: DUSB_N, DUSB_P, USB_N, USB_P, USB_R_N, USB_R_P
net class DE_SIG: DUSB_N, DUSB_P, USB_N, USB_P, USB_R_N, USB_R_P
net class USB: DUSB_N, DUSB_P, USB_N, USB_P, USB_R_N, USB_R_P

### Notes on the sheet
- verify crystal load capacitances
  39pF for crystals Rs >100R
- LPC1764 has 3 I2C controllers but can use pin mux to access 4 buses
- LPC1764:
  CPU: 100MHz
  FLASH 128KB
  SRAM:32KB
  Ethernet
  USB:slave
  CAN: 2
  I2S: no
  DAC: no
- (near IC1) Access Area 		Bit 7 Bit 6 Bit 5 Bit 4 Bit 3 Bit 2 Bit 1 Bit 0
  EEPROM 			1       0       1       0      A2     A1    A0    R/W
  EUI or Serial Number Read 	1       0       1       1      A2     A1    A0      1
- Copyright LNLS 2012.
  This documentation describes Open Hardware and is licensed under the CERN OHL v.1.1. You may redistribute and modify this documentation under the terms of the CERN OHL v.1.1. (http://ohwr.org/CERNOHL). This documentation is distributed WITHOUT ANY EXPRESS OR IMPLIED WARRANTY, INCLUDING OF MERCHANTABILITY, SATISFACTORY QUALITY AND FITNESS FOR A PARTICULAR PURPOSE. Please see the CERN OHL v.1.1 for applicable conditions.
- (in symbol LED_AVAGO_HSME-C120) Green

### Library data of the parts
C18 C19 C435 C444 = CAP_SMD_0402: Capacitor SMD; Supplier 1: Newark; Supplier Part Number 1: 14T3275
C21-C28 C436-C443 C445 = CAP_SMD_0201: Capacitor SMD
CON1 = CON_ISP: 6x 2.54mm SMT  dual row pin header
D1 = D_BAT165: 500mA, 40V, Shottky Diode
FB1 FB2 = L_FERRITE_BEAD_0402: ferrite bead 100R@100MHz 0.2A
IC1 = UPC_LPC1764: ARM Cortex-M3 procesor
IC3 = VMON_STM809: 2.93V  Reset circuit
IC4 IC5 = D_TVS_BZA462A: Quadruple 4V ESD transient voltage suppressor; Supplier 1: Newark; Supplier Part Number 1: 79R1868
IC25 = D_TVS_PRTR5V0U2X: dual 5.5 ESD transient voltage suppressor
J15 = CON_USB_B_MINI_TH: USB mini B connector (Molex); Part Number: 10133; Device: USB_Mini_AB
JP1 = CON_2x5 2.54 male SMT: Goldpin 2.54mm, male header
JP2 = CON_HEADER 5X2: PBTD10S
LDx LDy = LED_AVAGO_HSME-C120: LED BLUE; Author: CERN DEM JMW
LED17 = LED_0603R: LED 0603 red; Supplier 1: Newark; Supplier Part Number 1: 22M3004; Supplier 2: Newark; Supplier Part Number 2: 20M0618
Q8 = Q_BC857B: Transistor
R1-R36 R47 R51 R52 R56 R96-R102 R118-R123 R148-R157 R169-R176 R238 = RES_0402: SMD Resistor; Supplier 1: Newark; Supplier Part Number 1: 59M6691
TP1 TP2 TP8 TP10 = TP: Testpoint
U1 = UPC_ATxmega128A1-AU: 8/16-bit AVR XMEGA A1 Microcontroller, 1.6-3.6V, 128KB + 8KB Flash, 2KB EEPROM, 8KB SRAM, 100-pin TQFP, Industrial Grade (-40°C to 85°C), Pb-Free; Published: 1-Apr-2010; DatasheetVersion: revK, Feb-2010; PackageVersion: revC, Oct-2001; PackageReference: 100A; Publisher: Altium Limited; PackageDescription: 100-Pin Thin Profile Plastic Quad Flat Pack (TQFP), 14 x 14 x 1.0 mm Body, 0.5 mm Pitch; Supplier 1: Digi-Key; Supplier Part Number 1: ATXMEGA128A1-AU-ND; Supplier 2: Farnell; Supplier Part Number 2: 1704571; Supplier 3: Mouser; Supplier Part Number 3: 556-ATXMEGA128A1-AU; Code_JEDEC: MS-026-AED; ComponentLink1Description: Manufacturer Link; ComponentLink1URL: http://www.atmel.com/products/avr/default.asp?; ComponentLink2Description: ATxmega64A1/128A1/192A1/256A1/384A1 Datasheet; ComponentLink2URL: http://www.atmel.com/dyn/resources/prod_documents/doc8067.pdf; ComponentLink3Description: Atmel.com Home; ComponentLink3URL: http://www.atmel.com
X1 X2 = X_CRYSTAL_SMD_5.0*3.2: miniature crystal oscillator (Maritex) QSDG8M000-TXC

## Sheet USB_UART.SchDoc
size A4; DocumentNumber: 29; SheetNumber: 29; SheetTotal: 30
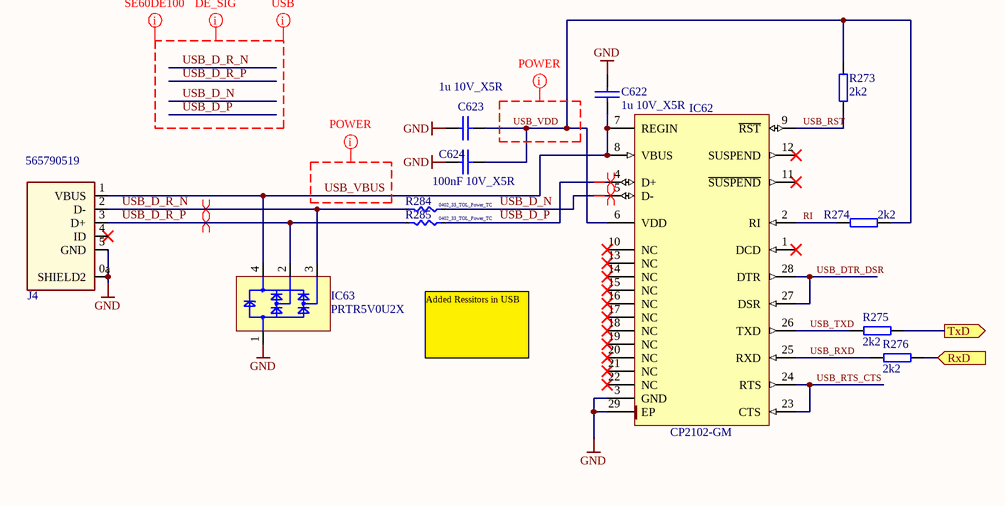
[diagram p14: USB_UART.SchDoc]

### Parts
C622  1u 10V_X5R  [0603C]
C623  1u 10V_X5R  [0603C]
C624  100nF 10V_X5R  [0402C]
IC62  CP2102-GM  [QFN50P500X500X100-29N-S335]
IC63  PRTR5V0U2X  [sot143b]
J4  565790519  [CON_USB_565790519]
R273  2k2  [0402R]
R274  2k2  [0402R]
R275  2k2  [0402R]
R276  2k2  [0402R]
R284  0402_33_TOL_Power_TC  [RESC1005X40N]
R285  0402_33_TOL_Power_TC  [RESC1005X40N]

### Ports
RxD (in), TxD (out)

### Nets
GND: C622.1 C623.1 C624.1 IC62.3(GND) IC62.29(EP) IC63.1 J4.0(SHIELD2) J4.0a(SHIELD2) J4.5(GND)
CONSOLE_RXD: R275.1 ; port TxD
CONSOLE_TXD: R276.1 ; port RxD
RI: IC62.2(RI) R274.1
USB_D_N: IC62.5(D-) R284.2(-)
USB_D_P: IC62.4(D+) R285.2(-)
USB_D_R_N: IC63.3 J4.2(D-) R284.1(+)
USB_D_R_P: IC63.2 J4.3(D+) R285.1(+)
USB_DTR_DSR: IC62.27(DSR) IC62.28(DTR)
USB_RST: IC62.9(~{RST}) R273.1
USB_RTS_CTS: IC62.23(CTS) IC62.24(RTS)
USB_RXD: IC62.25(RXD) R276.2
USB_TXD: IC62.26(TXD) R275.2
USB_VBUS: C622.2 IC62.7(REGIN) IC62.8(VBUS) IC63.4 J4.1(VBUS)
USB_VDD: C623.2 C624.2 IC62.6(VDD) R273.2 R274.2

Not connected (* = marked no-connect by the designer): IC62 1(DCD)* 10(NC)* 11(~{SUSPEND})* 12(SUSPEND)* 13(NC)* 14(NC)* 15(NC)* 16(NC)* 17(NC)* 18(NC)* 19(NC)* 20(NC)* 21(NC)* 22(NC)*; J4 4(ID)*

### Layout directives
differential pair: USB_D_N, USB_D_P, USB_D_R_N, USB_D_R_P
net class POWER: USB_VBUS, USB_VDD
net class SE60DE100: USB_D_N, USB_D_P, USB_D_R_N, USB_D_R_P
net class DE_SIG: USB_D_N, USB_D_P, USB_D_R_N, USB_D_R_P
net class USB: USB_D_N, USB_D_P, USB_D_R_N, USB_D_R_P

### Notes on the sheet
- Added Ressitors in USB

### Library data of the parts
C622 C623 = CAP_SMD_0603: Capacitor SMD; Supplier 1: Digi-Key; Supplier Part Number 1: 490-1524-2-ND
C624 = CAP_SMD_0402: Capacitor SMD; Supplier 1: Newark; Supplier Part Number 1: 14T3275
IC62 = CP2102-GM: Single-Chip USB to UART Bridge; Manufacturer: SILICON LABS; Table: Analog & Interface; Part Number: CP2102-GM; Component Kind: Standard; Component Type: Standard; Device: CP2102-GM; PackageDescription: QFN, 0.50mm Pitch, Square; 28 pin, 5.00mm L X 5.00mm W X 1.00mm H body (w/thermal tab 3.35 X 3.35mm),  IPC Medium Density; Part Description: Single-Chip USB to UART Bridge; Manufacturer Part Number: CP2102-GM; Pin Count: 29; Case: QFN28; Mounted: Yes; Socket: No; SMD: Yes; ComponentHeight: 1.0mm; Author: CERN DEM JLC; HelpURL: \\cern.ch\dfs\Applications\Altium\Datasheets\CP2102-GM.pdf; CreateDate: 3/3/2011; LatestRevisionDate: 3/3/2011
IC63 = D_TVS_PRTR5V0U2X: as IC25 on sheet CPU
J4 = CON_USB_B_MINI_TH: as J15 on sheet CPU
R273-R276 = RES_0402: SMD Resistor; Supplier 1: Newark; Supplier Part Number 1: 59M6691
R284 R285 = SMT_0402: MiscInfo: Biggest Cern Footprint [max height]; Document Name: USB_UART.SchDoc; Part Number: SMT_0402; FootprintSizeX (mm): 1.8; FootprintSizeY (mm): 0.9; FootprintRectangleArea (mm): 1.62; Thickness (Max) (mm): 0.4; FootprintAlias: 0402

## Sheet JTAG_Configuration.SchDoc
size A4; DocumentNumber: 8; SheetNumber: 8; SheetTotal: 30
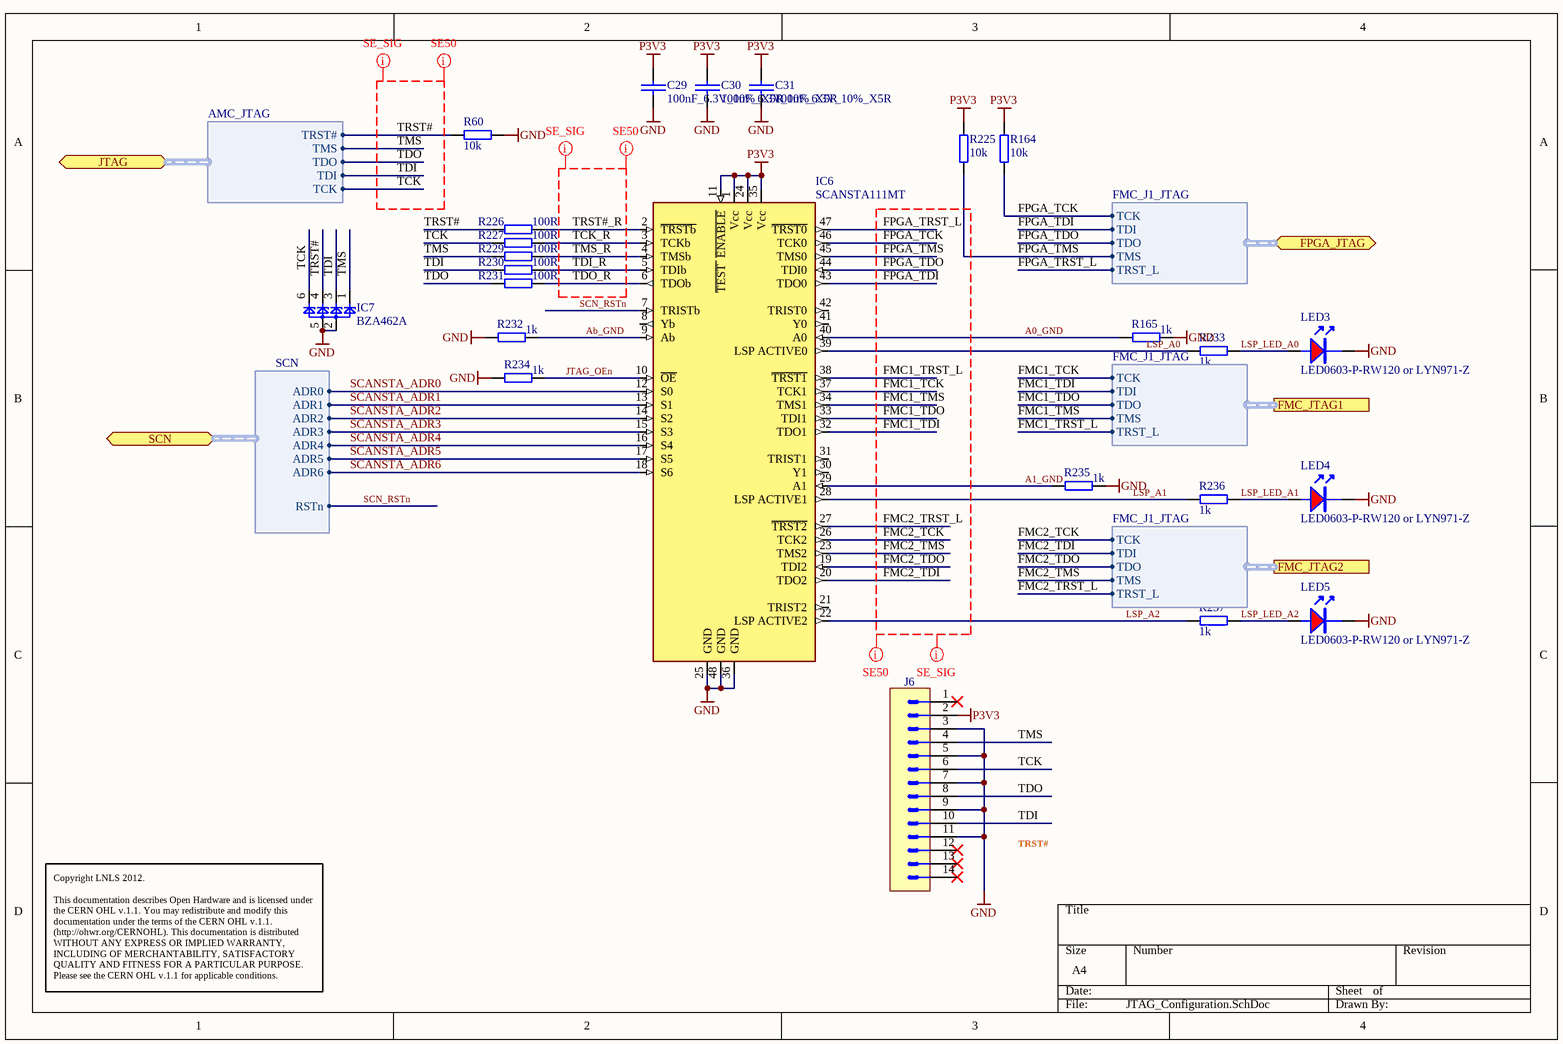
[diagram p15: JTAG_Configuration.SchDoc]

### Parts
C29  100nF_6.3V_10%_X5R  [0201C]
C30  100nF_6.3V_10%_X5R  [0201C]
C31  100nF_6.3V_10%_X5R  [0201C]
IC6  SCANSTA111MT  [TSSOP-48]
IC7  BZA462A  [SOT23-6]
J6  BHMT14S  [BHMT14S]  (value not drawn)
LED3  LED0603-P-RW120 or LYN971-Z  [led_0603R]
LED4  LED0603-P-RW120 or LYN971-Z  [led_0603R]
LED5  LED0603-P-RW120 or LYN971-Z  [led_0603R]
R60  10k  [0402R]
R164  10k  [0402R]
R165  1k  [0402R]
R225  10k  [0402R]
R226  100R  [0402R]
R227  100R  [0402R]
R229  100R  [0402R]
R230  100R  [0402R]
R231  100R  [0402R]
R232  1k  [0402R]
R233  1k  [0402R]
R234  1k  [0402R]
R235  1k  [0402R]
R236  1k  [0402R]
R237  1k  [0402R]

### Ports
FMC_JTAG1 (harness FMC_J1_JTAG), FMC_JTAG2 (harness FMC_J1_JTAG), FPGA_JTAG (harness FMC_J1_JTAG), JTAG (harness AMC_JTAG), SCN (harness SCN)

### Harnesses
FMC_J1_JTAG: TCK, TDI, TDO, TMS, TRST_L
AMC_JTAG: TCK, TDI, TDO, TMS, TRST#
SCN: ADR0, ADR1, ADR2, ADR3, ADR4, ADR5, ADR6, RSTn

### Nets
GND: C29.2 C30.2 C31.2 IC6.25(GND) IC6.36(GND) IC6.48(GND) IC7.2 IC7.5 J6.3 J6.5 J6.7 J6.9 J6.11 LED3.K LED4.K LED5.K R60.1 R165.2 R232.1 R234.1 R235.2
P3V3: C29.1 C30.1 C31.1 IC6.1(Vcc) IC6.11(~{TEST_}_~{ENABLE}) IC6.24(Vcc) IC6.35(Vcc) J6.2 R164.2 R225.2
A0_GND: IC6.40(A0) R165.1
A1_GND: IC6.29(A1) R235.1
Ab_GND: IC6.9(Ab) R232.2
FMC1_TCK: IC6.37(TCK1) ; port FMC_JTAG1.TCK  [project net JTAG1.TCK]
FMC1_TDI: IC6.32(TDO1) ; port FMC_JTAG1.TDI  [project net JTAG1.TDI]
FMC1_TDO: IC6.33(TDI1) ; port FMC_JTAG1.TDO  [project net JTAG1.TDO]
FMC1_TMS: IC6.34(TMS1) ; port FMC_JTAG1.TMS  [project net JTAG1.TMS]
FMC1_TRST_L: IC6.38(~{TRST1}) ; port FMC_JTAG1.TRST_L  [project net JTAG1.TRST_L]
FMC2_TCK: IC6.26(TCK2) ; port FMC_JTAG2.TCK  [project net JTAG2.TCK]
FMC2_TDI: IC6.20(TDO2) ; port FMC_JTAG2.TDI  [project net JTAG2.TDI]
FMC2_TDO: IC6.19(TDI2) ; port FMC_JTAG2.TDO  [project net JTAG2.TDO]
FMC2_TMS: IC6.23(TMS2) ; port FMC_JTAG2.TMS  [project net JTAG2.TMS]
FMC2_TRST_L: IC6.27(~{TRST2}) ; port FMC_JTAG2.TRST_L  [project net JTAG2.TRST_L]
FPGA_TCK: IC6.46(TCK0) R164.1 ; port FPGA_JTAG.TCK  [project net FJTAG.TCK]
FPGA_TDI: IC6.43(TDO0) ; port FPGA_JTAG.TDI  [project net FJTAG.TDI]
FPGA_TDO: IC6.44(TDI0) ; port FPGA_JTAG.TDO  [project net FJTAG.TDO]
FPGA_TMS: IC6.45(TMS0) R225.1 ; port FPGA_JTAG.TMS  [project net FJTAG.TMS]
FPGA_TRST_L: IC6.47(~{TRST0}) ; port FPGA_JTAG.TRST_L  [project net FJTAG.TRST_L]
JTAG_OEn: IC6.10(~{OE}) R234.2
LSP_A0: IC6.39(LSP_ACTIVE0) R233.1
LSP_A1: IC6.28(LSP_ACTIVE1) R236.1
LSP_A2: IC6.22(LSP_ACTIVE2) R237.1
LSP_LED_A0: LED3.A R233.2
LSP_LED_A1: LED4.A R236.2
LSP_LED_A2: LED5.A R237.2
SCANSTA_ADR0: IC6.12(S0) ; port SCN.ADR0  [project net SCN.ADR0]
SCANSTA_ADR1: IC6.13(S1) ; port SCN.ADR1  [project net SCN.ADR1]
SCANSTA_ADR2: IC6.14(S2) ; port SCN.ADR2  [project net SCN.ADR2]
SCANSTA_ADR3: IC6.15(S3) ; port SCN.ADR3  [project net SCN.ADR3]
SCANSTA_ADR4: IC6.16(S4) ; port SCN.ADR4  [project net SCN.ADR4]
SCANSTA_ADR5: IC6.17(S5) ; port SCN.ADR5  [project net SCN.ADR5]
SCANSTA_ADR6: IC6.18(S6) ; port SCN.ADR6  [project net SCN.ADR6]
SCN_RSTn: IC6.7(TRISTb) ; port SCN.RSTn  [project net SCN.RSTn]
TCK: IC7.6 J6.6 R227.1 ; port JTAG.TCK  [project net AJTAG.TCK]
TCK_R: IC6.3(TCKb) R227.2
TDI: IC7.3 J6.10 R230.1 ; port JTAG.TDI  [project net AJTAG.TDI]
TDI_R: IC6.5(TDIb) R230.2
TDO: J6.8 R231.1 ; port JTAG.TDO  [project net AJTAG.TDO]
TDO_R: IC6.6(TDOb) R231.2
TMS: IC7.1 J6.4 R229.1 ; port JTAG.TMS  [project net AJTAG.TMS]
TMS_R: IC6.4(TMSb) R229.2
TRST#: IC7.4 R60.2 R226.1 ; port JTAG.TRST#  [project net AJTAG.TRST#]
TRST#_R: IC6.2(~{TRSTb}) R226.2

Not connected (* = marked no-connect by the designer): IC6 8(Yb) 21(TRIST2) 30(Y1) 31(TRIST1) 41(Y0) 42(TRIST0); J6 1* 12* 13* 14*

### Layout directives
net class SE_SIG: FMC1_TCK, FMC1_TDI, FMC1_TDO, FMC1_TMS, FMC1_TRST_L, FMC2_TCK, FMC2_TDI, FMC2_TDO, FMC2_TMS, FMC2_TRST_L, FPGA_TCK, FPGA_TDI, FPGA_TDO, FPGA_TMS, FPGA_TRST_L, TCK, TCK_R, TDI, TDI_R, TDO, TDO_R, TMS, TMS_R, TRST#, TRST#_R
net class SE50: FMC1_TCK, FMC1_TDI, FMC1_TDO, FMC1_TMS, FMC1_TRST_L, FMC2_TCK, FMC2_TDI, FMC2_TDO, FMC2_TMS, FMC2_TRST_L, FPGA_TCK, FPGA_TDI, FPGA_TDO, FPGA_TMS, FPGA_TRST_L, TCK, TCK_R, TDI, TDI_R, TDO, TDO_R, TMS, TMS_R, TRST#, TRST#_R

### Notes on the sheet
- TRST#
- Copyright LNLS 2012.
  This documentation describes Open Hardware and is licensed under the CERN OHL v.1.1. You may redistribute and modify this documentation under the terms of the CERN OHL v.1.1. (http://ohwr.org/CERNOHL). This documentation is distributed WITHOUT ANY EXPRESS OR IMPLIED WARRANTY, INCLUDING OF MERCHANTABILITY, SATISFACTORY QUALITY AND FITNESS FOR A PARTICULAR PURPOSE. Please see the CERN OHL v.1.1 for applicable conditions.

### Library data of the parts
C29-C31 = CAP_SMD_0201: Capacitor SMD
IC6 = IFC_SCANSTA111: Enhanced SCAN Bridge Multidrop Addressable IEEE 1149.1 (JTAG) Port; Supplier 1: Digi-Key; Supplier Part Number 1: SCANSTA111MT-ND
IC7 = D_TVS_BZA462A: as IC4 on sheet CPU; Supplier 1: Newark; Supplier Part Number 1: 79R1868
J6 = MOLEX_87831-1420: Connector 14 Male; Part Description: 2.00mm (.079") Pitch Milli-Grid™ Header, Vertical, Shrouded, Center Polarization Slot, Locking Window, 14 Circuits; Part Number: BHMT14S; Component Kind: Standard; Component Type: Standard; Pin Count: 14; Family: Milli-Grid™; Mounted: Yes; Socket: No; SMD: No; Status: None; Manufacturer Part Number: BHMT14S; ComponentHeight: 6.4mm; Author: CERN DEM JLC; CreateDate: 2010-04-13; LatestRevisionDate: 2010-04-13
LED3-LED5 = LED_0603R: LED 0603 red; Supplier 1: Newark; Supplier Part Number 1: 22M3004
R60 R164 R165 R225-R227 R229-R237 = RES_0402: SMD Resistor; Supplier 1: Newark; Supplier Part Number 1: 59M6691

## Sheet M-LVDS PHY.SchDoc
size A4; DocumentNumber: 22; SheetNumber: 22; SheetTotal: 30
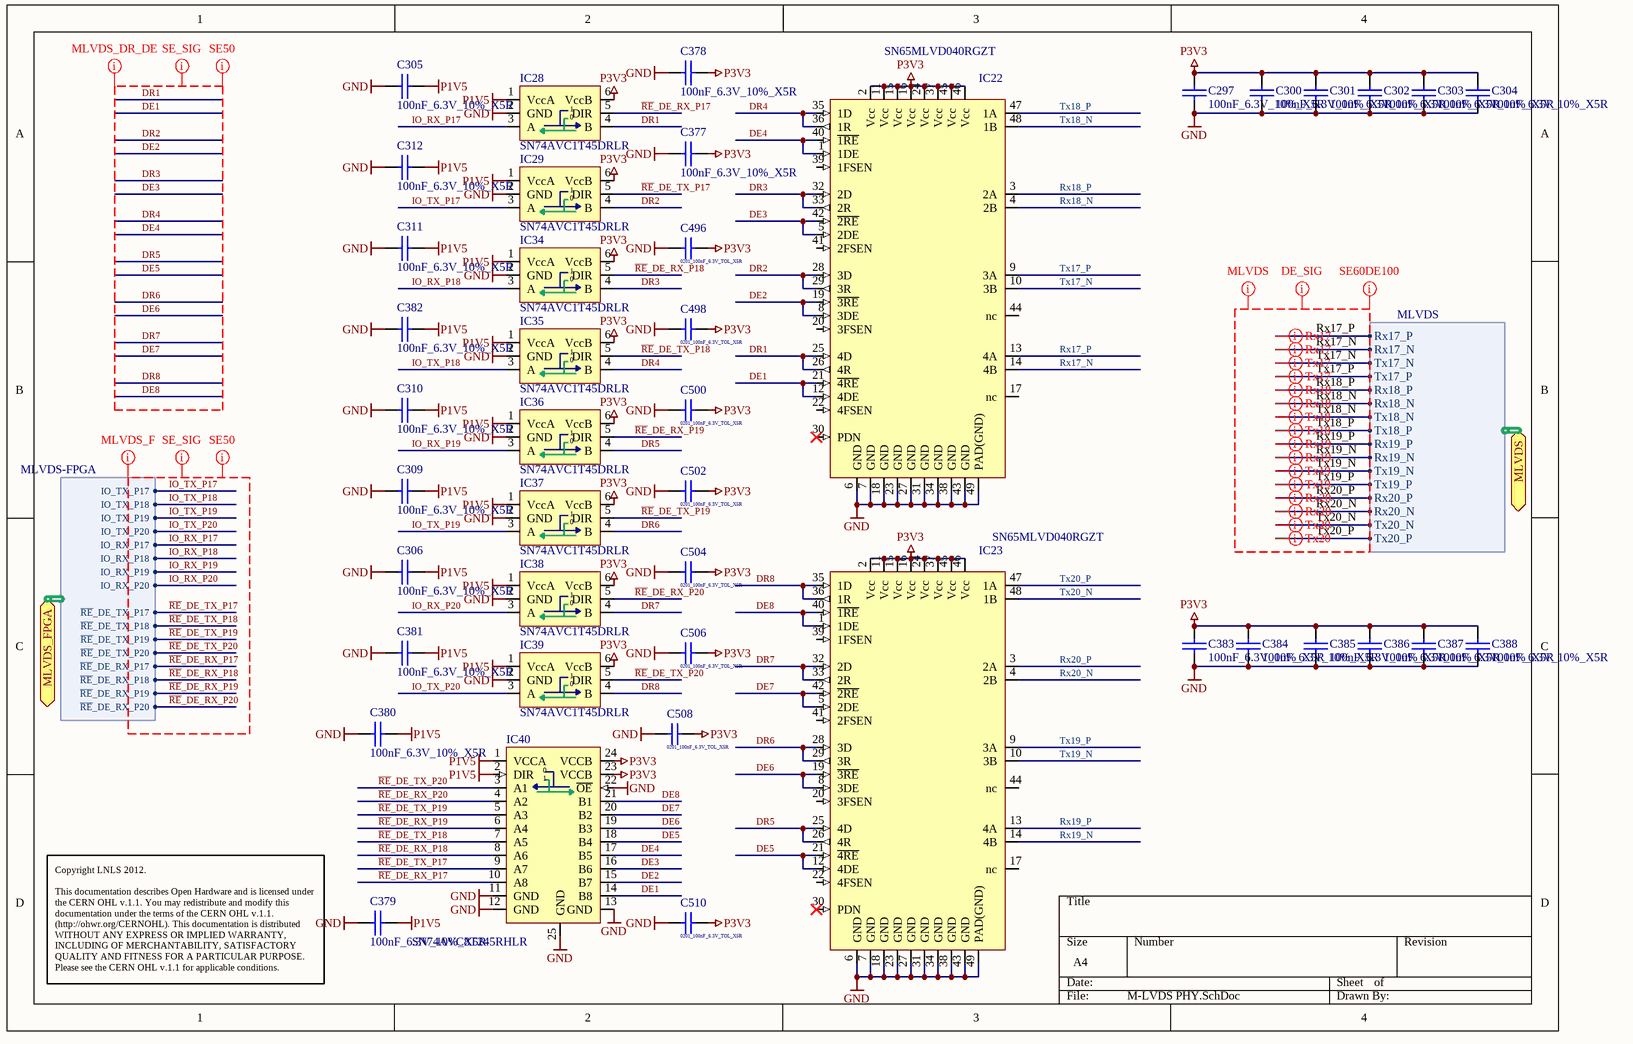
[diagram p16: M-LVDS PHY.SchDoc]

### Parts
C297  100nF_6.3V_10%_X5R  [0201C]
C300  100nF_6.3V_10%_X5R  [0201C]
C301  100nF_6.3V_10%_X5R  [0201C]
C302  100nF_6.3V_10%_X5R  [0201C]
C303  100nF_6.3V_10%_X5R  [0201C]
C304  100nF_6.3V_10%_X5R  [0201C]
C305  100nF_6.3V_10%_X5R  [0201C]
C306  100nF_6.3V_10%_X5R  [0201C]
C309  100nF_6.3V_10%_X5R  [0201C]
C310  100nF_6.3V_10%_X5R  [0201C]
C311  100nF_6.3V_10%_X5R  [0201C]
C312  100nF_6.3V_10%_X5R  [0201C]
C377  100nF_6.3V_10%_X5R  [0201C]
C378  100nF_6.3V_10%_X5R  [0201C]
C379  100nF_6.3V_10%_X5R  [0201C]
C380  100nF_6.3V_10%_X5R  [0201C]
C381  100nF_6.3V_10%_X5R  [0201C]
C382  100nF_6.3V_10%_X5R  [0201C]
C383  100nF_6.3V_10%_X5R  [0201C]
C384  100nF_6.3V_10%_X5R  [0201C]
C385  100nF_6.3V_10%_X5R  [0201C]
C386  100nF_6.3V_10%_X5R  [0201C]
C387  100nF_6.3V_10%_X5R  [0201C]
C388  100nF_6.3V_10%_X5R  [0201C]
C496  0201_100nF_6.3V_TOL_X5R  [CAPC0603X33N]
C498  0201_100nF_6.3V_TOL_X5R  [CAPC0603X33N]
C500  0201_100nF_6.3V_TOL_X5R  [CAPC0603X33N]
C502  0201_100nF_6.3V_TOL_X5R  [CAPC0603X33N]
C504  0201_100nF_6.3V_TOL_X5R  [CAPC0603X33N]
C506  0201_100nF_6.3V_TOL_X5R  [CAPC0603X33N]
C508  0201_100nF_6.3V_TOL_X5R  [CAPC0603X33N]
C510  0201_100nF_6.3V_TOL_X5R  [CAPC0603X33N]
IC22  SN65MLVD040RGZT  [QFN48L]
IC23  SN65MLVD040RGZT  [QFN48L]
IC28  SN74AVC1T45DRLR  [SOT-553]
IC29  SN74AVC1T45DRLR  [SOT-553]
IC34  SN74AVC1T45DRLR  [SOT-553]
IC35  SN74AVC1T45DRLR  [SOT-553]
IC36  SN74AVC1T45DRLR  [SOT-553]
IC37  SN74AVC1T45DRLR  [SOT-553]
IC38  SN74AVC1T45DRLR  [SOT-553]
IC39  SN74AVC1T45DRLR  [SOT-553]
IC40  SN74AVC8T245RHLR  [QFN50P350X550X100-24N]

### Ports
MLVDS (harness MLVDS), MLVDS_FPGA (harness MLVDS-FPGA)

### Harnesses
MLVDS: Rx17_P, Rx17_N, Tx17_N, Tx17_P, Rx18_P, Rx18_N, Tx18_N, Tx18_P, Rx19_P, Rx19_N, Tx19_N, Tx19_P, Rx20_P, Rx20_N, Tx20_N, Tx20_P
MLVDS-FPGA: IO_TX_P17, IO_TX_P18, IO_TX_P19, IO_TX_P20, IO_RX_P17, IO_RX_P18, IO_RX_P19, IO_RX_P20, ~{RE}_DE_TX_P17, ~{RE}_DE_TX_P18, ~{RE}_DE_TX_P19, ~{RE}_DE_TX_P20, ~{RE}_DE_RX_P17, ~{RE}_DE_RX_P18, ~{RE}_DE_RX_P19, ~{RE}_DE_RX_P20

### Nets
GND: C297.2 C300.2 C301.2 C302.2 C303.2 C304.2 C305.2 C306.1 C309.1 C310.1 C311.1 C312.1 C377.1 C378.1 C379.1 C380.1 C381.1 C382.1 C383.2 C384.2 C385.2 C386.2 C387.2 C388.2 C496.2 C498.2 C500.2 C502.2 C504.2 C506.2 C508.2 C510.2 IC22.6(GND) IC22.7(GND) IC22.18(GND) IC22.23(GND) IC22.27(GND) IC22.31(GND) IC22.34(GND) IC22.38(GND) IC22.43(GND) IC22.49(PAD(GND)) IC23.6(GND) IC23.7(GND) IC23.18(GND) IC23.23(GND) IC23.27(GND) IC23.31(GND) IC23.34(GND) IC23.38(GND) IC23.43(GND) IC23.49(PAD(GND)) IC28.2(GND) IC29.2(GND) IC34.2(GND) IC35.2(GND) IC36.2(GND) IC37.2(GND) IC38.2(GND) IC39.2(GND) IC40.11(GND) IC40.12(GND) IC40.13(GND) IC40.22(~{OE}) IC40.25(GND)
P1V5: C305.1 C306.2 C309.2 C310.2 C311.2 C312.2 C379.2 C380.2 C381.2 C382.2 IC28.1(VccA) IC29.1(VccA) IC34.1(VccA) IC35.1(VccA) IC36.1(VccA) IC37.1(VccA) IC38.1(VccA) IC39.1(VccA) IC40.1(VCCA) IC40.2(DIR)
P3V3: C297.1 C300.1 C301.1 C302.1 C303.1 C304.1 C377.2 C378.2 C383.1 C384.1 C385.1 C386.1 C387.1 C388.1 C496.1 C498.1 C500.1 C502.1 C504.1 C506.1 C508.1 C510.1 IC22.2(Vcc) IC22.11(Vcc) IC22.15(Vcc) IC22.16(Vcc) IC22.24(Vcc) IC22.37(Vcc) IC22.45(Vcc) IC22.46(Vcc) IC23.2(Vcc) IC23.11(Vcc) IC23.15(Vcc) IC23.16(Vcc) IC23.24(Vcc) IC23.37(Vcc) IC23.45(Vcc) IC23.46(Vcc) IC28.6(VccB) IC29.6(VccB) IC34.6(VccB) IC35.6(VccB) IC36.6(VccB) IC37.6(VccB) IC38.6(VccB) IC39.6(VccB) IC40.23(VCCB) IC40.24(VCCB)
DE1: IC22.12(4DE) IC22.21(~{4RE}) IC40.14(B8)
DE2: IC22.8(3DE) IC22.19(~{3RE}) IC40.15(B7)
DE3: IC22.5(2DE) IC22.42(~{2RE}) IC40.16(B6)
DE4: IC22.1(1DE) IC22.40(~{1RE}) IC40.17(B5)
DE5: IC23.12(4DE) IC23.21(~{4RE}) IC40.18(B4)
DE6: IC23.8(3DE) IC23.19(~{3RE}) IC40.19(B3)
DE7: IC23.5(2DE) IC23.42(~{2RE}) IC40.20(B2)
DE8: IC23.1(1DE) IC23.40(~{1RE}) IC40.21(B1)
DR1: IC22.25(4D) IC22.26(4R) IC28.4(B)
DR2: IC22.28(3D) IC22.29(3R) IC29.4(B)
DR3: IC22.32(2D) IC22.33(2R) IC34.4(B)
DR4: IC22.35(1D) IC22.36(1R) IC35.4(B)
DR5: IC23.25(4D) IC23.26(4R) IC36.4(B)
DR6: IC23.28(3D) IC23.29(3R) IC37.4(B)
DR7: IC23.32(2D) IC23.33(2R) IC38.4(B)
DR8: IC23.35(1D) IC23.36(1R) IC39.4(B)
IO_RX_P17: IC28.3(A) ; port MLVDS_FPGA.IO_RX_P17  [project net MLVDS_F.IO_RX_P17]
IO_RX_P18: IC34.3(A) ; port MLVDS_FPGA.IO_RX_P18  [project net MLVDS_F.IO_RX_P18]
IO_RX_P19: IC36.3(A) ; port MLVDS_FPGA.IO_RX_P19  [project net MLVDS_F.IO_RX_P19]
IO_RX_P20: IC38.3(A) ; port MLVDS_FPGA.IO_RX_P20  [project net MLVDS_F.IO_RX_P20]
IO_TX_P17: IC29.3(A) ; port MLVDS_FPGA.IO_TX_P17  [project net MLVDS_F.IO_TX_P17]
IO_TX_P18: IC35.3(A) ; port MLVDS_FPGA.IO_TX_P18  [project net MLVDS_F.IO_TX_P18]
IO_TX_P19: IC37.3(A) ; port MLVDS_FPGA.IO_TX_P19  [project net MLVDS_F.IO_TX_P19]
IO_TX_P20: IC39.3(A) ; port MLVDS_FPGA.IO_TX_P20  [project net MLVDS_F.IO_TX_P20]
~{RE}_DE_RX_P17: IC28.5(DIR) IC40.10(A8) ; port MLVDS_FPGA.~{RE}_DE_RX_P17  [project net MLVDS_F.~{RE}_DE_RX_P17]
~{RE}_DE_RX_P18: IC34.5(DIR) IC40.8(A6) ; port MLVDS_FPGA.~{RE}_DE_RX_P18  [project net MLVDS_F.~{RE}_DE_RX_P18]
~{RE}_DE_RX_P19: IC36.5(DIR) IC40.6(A4) ; port MLVDS_FPGA.~{RE}_DE_RX_P19  [project net MLVDS_F.~{RE}_DE_RX_P19]
~{RE}_DE_RX_P20: IC38.5(DIR) IC40.4(A2) ; port MLVDS_FPGA.~{RE}_DE_RX_P20  [project net MLVDS_F.~{RE}_DE_RX_P20]
~{RE}_DE_TX_P17: IC29.5(DIR) IC40.9(A7) ; port MLVDS_FPGA.~{RE}_DE_TX_P17  [project net MLVDS_F.~{RE}_DE_TX_P17]
~{RE}_DE_TX_P18: IC35.5(DIR) IC40.7(A5) ; port MLVDS_FPGA.~{RE}_DE_TX_P18  [project net MLVDS_F.~{RE}_DE_TX_P18]
~{RE}_DE_TX_P19: IC37.5(DIR) IC40.5(A3) ; port MLVDS_FPGA.~{RE}_DE_TX_P19  [project net MLVDS_F.~{RE}_DE_TX_P19]
~{RE}_DE_TX_P20: IC39.5(DIR) IC40.3(A1) ; port MLVDS_FPGA.~{RE}_DE_TX_P20  [project net MLVDS_F.~{RE}_DE_TX_P20]
Rx17_N: IC22.14(4B) ; port MLVDS.Rx17_N  [project net MLVDS_A.Rx17_N]
Rx17_P: IC22.13(4A) ; port MLVDS.Rx17_P  [project net MLVDS_A.Rx17_P]
Rx18_N: IC22.4(2B) ; port MLVDS.Rx18_N  [project net MLVDS_A.Rx18_N]
Rx18_P: IC22.3(2A) ; port MLVDS.Rx18_P  [project net MLVDS_A.Rx18_P]
Rx19_N: IC23.14(4B) ; port MLVDS.Rx19_N  [project net MLVDS_A.Rx19_N]
Rx19_P: IC23.13(4A) ; port MLVDS.Rx19_P  [project net MLVDS_A.Rx19_P]
Rx20_N: IC23.4(2B) ; port MLVDS.Rx20_N  [project net MLVDS_A.Rx20_N]
Rx20_P: IC23.3(2A) ; port MLVDS.Rx20_P  [project net MLVDS_A.Rx20_P]
Tx17_N: IC22.10(3B) ; port MLVDS.Tx17_N  [project net MLVDS_A.Tx17_N]
Tx17_P: IC22.9(3A) ; port MLVDS.Tx17_P  [project net MLVDS_A.Tx17_P]
Tx18_N: IC22.48(1B) ; port MLVDS.Tx18_N  [project net MLVDS_A.Tx18_N]
Tx18_P: IC22.47(1A) ; port MLVDS.Tx18_P  [project net MLVDS_A.Tx18_P]
Tx19_N: IC23.10(3B) ; port MLVDS.Tx19_N  [project net MLVDS_A.Tx19_N]
Tx19_P: IC23.9(3A) ; port MLVDS.Tx19_P  [project net MLVDS_A.Tx19_P]
Tx20_N: IC23.48(1B) ; port MLVDS.Tx20_N  [project net MLVDS_A.Tx20_N]
Tx20_P: IC23.47(1A) ; port MLVDS.Tx20_P  [project net MLVDS_A.Tx20_P]

Not connected (* = marked no-connect by the designer): IC22 17(nc) 20(3FSEN) 22(4FSEN) 30(PDN)* 39(1FSEN) 41(2FSEN) 44(nc); IC23 17(nc) 20(3FSEN) 22(4FSEN) 30(PDN)* 39(1FSEN) 41(2FSEN) 44(nc)

### Layout directives
differential pair: MLVDS_A.Rx17_N, MLVDS_A.Rx17_P, MLVDS_A.Rx18_N, MLVDS_A.Rx18_P, MLVDS_A.Rx19_N, MLVDS_A.Rx19_P, MLVDS_A.Rx20_N, MLVDS_A.Rx20_P, MLVDS_A.Tx17_N, MLVDS_A.Tx17_P, MLVDS_A.Tx18_N, MLVDS_A.Tx18_P, MLVDS_A.Tx19_N, MLVDS_A.Tx19_P, MLVDS_A.Tx20_N, MLVDS_A.Tx20_P
net class MLVDS: Rx17_N, Rx17_P, Rx18_N, Rx18_P, Rx19_N, Rx19_P, Rx20_N, Rx20_P, Tx17_N, Tx17_P, Tx18_N, Tx18_P, Tx19_N, Tx19_P, Tx20_N, Tx20_P
net class DE_SIG: Rx17_N, Rx17_P, Rx18_N, Rx18_P, Rx19_N, Rx19_P, Rx20_N, Rx20_P, Tx17_N, Tx17_P, Tx18_N, Tx18_P, Tx19_N, Tx19_P, Tx20_N, Tx20_P
net class SE60DE100: Rx17_N, Rx17_P, Rx18_N, Rx18_P, Rx19_N, Rx19_P, Rx20_N, Rx20_P, Tx17_N, Tx17_P, Tx18_N, Tx18_P, Tx19_N, Tx19_P, Tx20_N, Tx20_P
net class MLVDS_F: IO_RX_P17, IO_RX_P18, IO_RX_P19, IO_RX_P20, IO_TX_P17, IO_TX_P18, IO_TX_P19, IO_TX_P20, ~{RE}_DE_RX_P17, ~{RE}_DE_RX_P18, ~{RE}_DE_RX_P19, ~{RE}_DE_RX_P20, ~{RE}_DE_TX_P17, ~{RE}_DE_TX_P18, ~{RE}_DE_TX_P19, ~{RE}_DE_TX_P20
net class SE50: DE1, DE2, DE3, DE4, DE5, DE6, DE7, DE8, DR1, DR2, DR3, DR4, DR5, DR6, DR7, DR8, IO_RX_P17, IO_RX_P18, IO_RX_P19, IO_RX_P20, IO_TX_P17, IO_TX_P18, IO_TX_P19, IO_TX_P20, ~{RE}_DE_RX_P17, ~{RE}_DE_RX_P18, ~{RE}_DE_RX_P19, ~{RE}_DE_RX_P20, ~{RE}_DE_TX_P17, ~{RE}_DE_TX_P18, ~{RE}_DE_TX_P19, ~{RE}_DE_TX_P20
net class SE_SIG: DE1, DE2, DE3, DE4, DE5, DE6, DE7, DE8, DR1, DR2, DR3, DR4, DR5, DR6, DR7, DR8, IO_RX_P17, IO_RX_P18, IO_RX_P19, IO_RX_P20, IO_TX_P17, IO_TX_P18, IO_TX_P19, IO_TX_P20, ~{RE}_DE_RX_P17, ~{RE}_DE_RX_P18, ~{RE}_DE_RX_P19, ~{RE}_DE_RX_P20, ~{RE}_DE_TX_P17, ~{RE}_DE_TX_P18, ~{RE}_DE_TX_P19, ~{RE}_DE_TX_P20
net class MLVDS_DR_DE: DE1, DE2, DE3, DE4, DE5, DE6, DE7, DE8, DR1, DR2, DR3, DR4, DR5, DR6, DR7, DR8

### Notes on the sheet
- Copyright LNLS 2012.
  This documentation describes Open Hardware and is licensed under the CERN OHL v.1.1. You may redistribute and modify this documentation under the terms of the CERN OHL v.1.1. (http://ohwr.org/CERNOHL). This documentation is distributed WITHOUT ANY EXPRESS OR IMPLIED WARRANTY, INCLUDING OF MERCHANTABILITY, SATISFACTORY QUALITY AND FITNESS FOR A PARTICULAR PURPOSE. Please see the CERN OHL v.1.1 for applicable conditions.
- (in symbol 74AVC1T45) 0
- (in symbol 74AVC8T245_QFN) 0

### Library data of the parts
C297 C300-C306 C309-C312 C377-C388 = CAP_SMD_0201: Capacitor SMD
C496 C498 C500 C502 C504 C506 C508 C510 = Ceramic_0201: MiscInfo: Biggest Cern Footprint [max height]; Document Name: M-LVDS PHY.SchDoc; Part Number: Ceramic_0201; FootprintSizeX (mm): 1.5; FootprintSizeY (mm): 0.7; FootprintRectangleArea (mm): 1.05; Thickness (Max) (mm): 0.33; FootprintAlias: 0201
IC22 IC23 = IFC_SN65MLVD040
IC28 IC29 IC34-IC39 = 74AVC1T45: 1-bit Transceiver Dual Supply (1.4...3.6V)
IC40 = 74AVC8T245_QFN: 8 channel bidir translator buffer (1.4..3.6V)